# Altium schematic sheet MCU.SchDoc
size A4
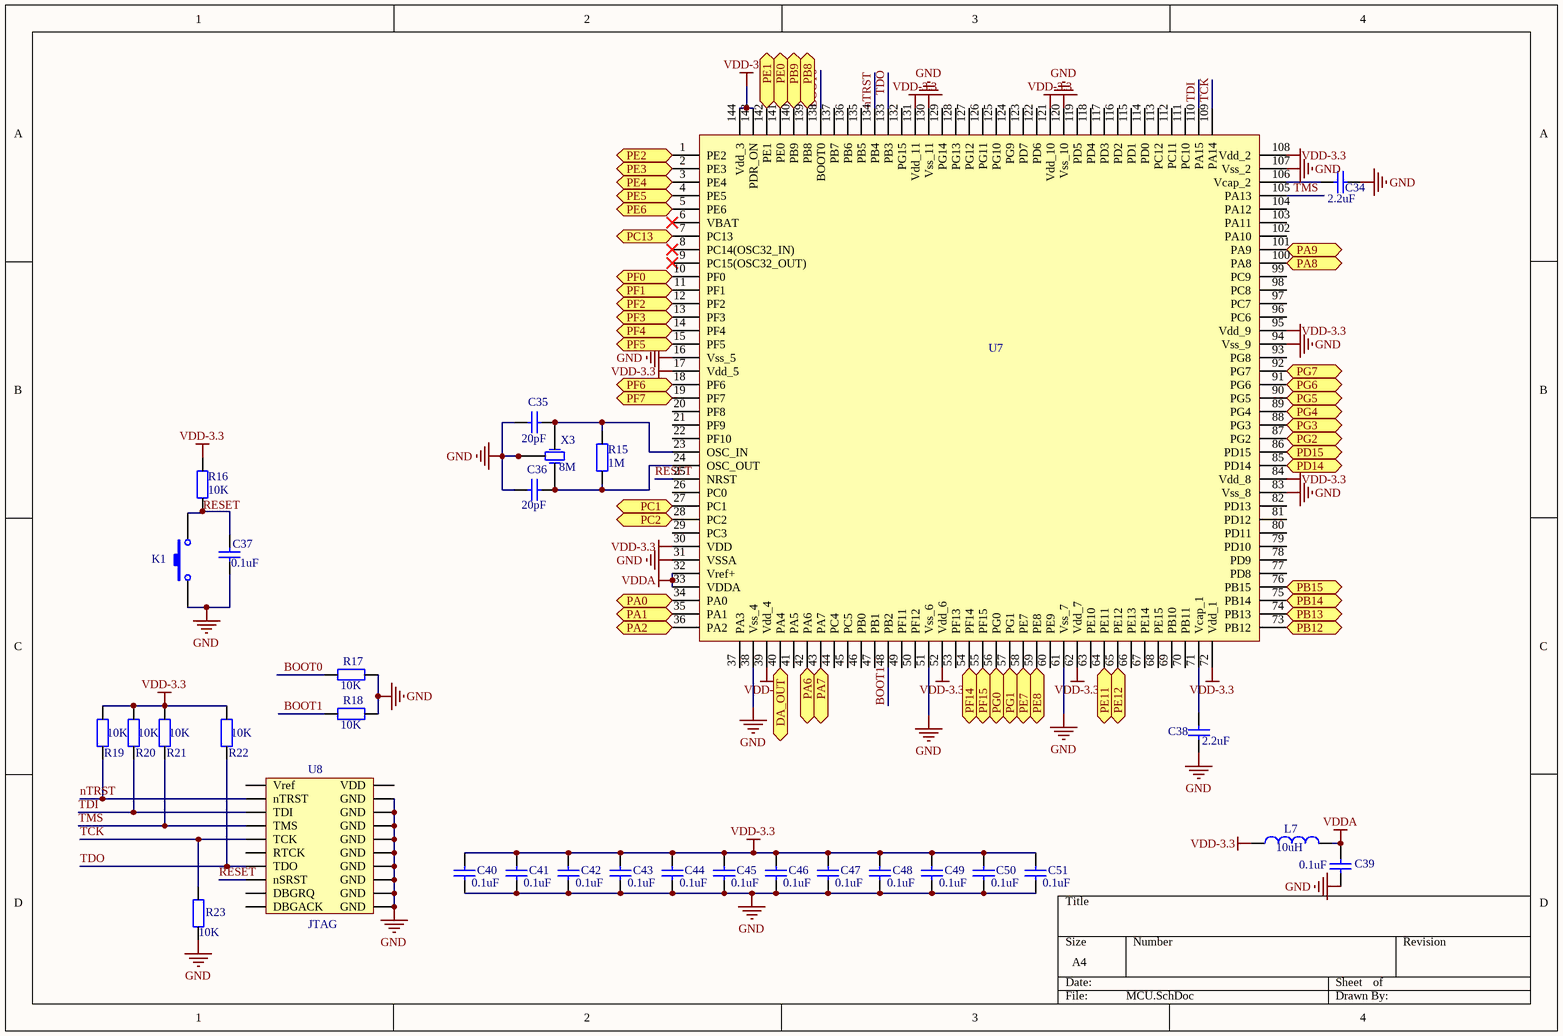
[diagram p0: MCU.SchDoc]

## Parts
C34  value 2.2uF  [0603]  (hidden comment: Capacitor-0603)
C35  value 20pF  [0603]  (hidden comment: Capacitor-0603)
C36  value 20pF  [0603]  (hidden comment: Capacitor-0603)
C37  value 0.1uF  [0603]  (hidden comment: Capacitor-0805)
C38  value 2.2uF  [0603]  (hidden comment: Capacitor-0603)
C39  value 0.1uF  [0603]  (hidden comment: Capacitor-0805)
C40  value 0.1uF  [0603]  (hidden comment: Capacitor-0603)
C41  value 0.1uF  [0603]  (hidden comment: Capacitor-0603)
C42  value 0.1uF  [0603]  (hidden comment: Capacitor-0603)
C43  value 0.1uF  [0603]  (hidden comment: Capacitor-0603)
C44  value 0.1uF  [0603]  (hidden comment: Capacitor-0603)
C45  value 0.1uF  [0603]  (hidden comment: Capacitor-0603)
C46  value 0.1uF  [0603]  (hidden comment: Capacitor-0603)
C47  value 0.1uF  [0603]  (hidden comment: Capacitor-0603)
C48  value 0.1uF  [0603]  (hidden comment: Capacitor-0603)
C49  value 0.1uF  [0603]  (hidden comment: Capacitor-0603)
C50  value 0.1uF  [0603]  (hidden comment: Capacitor-0603)
C51  value 0.1uF  [0603]  (hidden comment: Capacitor-0603)
K1  按键  [贴片按键]  (value not drawn)
L7  value 10uH  [0805]  (hidden comment: Inductor)
R15  value 1M  [0603]  (hidden comment: Resistor-0603)
R16  value 10K  [0603]  (hidden comment: Resistor-0805)
R17  value 10K  [0603]  (hidden comment: Resistor-0805)
R18  value 10K  [0603]  (hidden comment: Resistor-0805)
R19  value 10K  [0603]  (hidden comment: Resistor-0805)
R20  value 10K  [0603]  (hidden comment: Resistor-0805)
R21  value 10K  [0603]  (hidden comment: Resistor-0805)
R22  value 10K  [0603]  (hidden comment: Resistor-0805)
R23  value 10K  [0603]  (hidden comment: Resistor-0805)
U7  value STM32F407ZET6  [Stm32f407ZET6 - duplicate]  (hidden comment: STM32F407ZGT6)
U8  JTAG  [JTAG-20]
X3  value 8M  [3225无源晶振]  (hidden comment: 3225无源晶振)

## Ports
DA_OUT (out), PA0 (out), PA1 (out), PA2 (out), PA6 (out), PA7 (out), PA8, PA9, PB8 (out), PB9 (out), PB12, PB13, PB14, PB15, PC1 (out), PC2 (out), PC13 (out), PD14, PD15, PE0 (out), PE1 (out), PE2 (out), PE3 (out), PE4 (out), PE5 (out), PE6 (out), PE7 (out), PE8 (out), PE11 (out), PE12 (out), PF0 (out), PF1 (out), PF2 (out), PF3 (out), PF4 (out), PF5 (out), PF6 (out), PF7 (out), PF14 (out), PF15 (out), PG0 (out), PG1 (out), PG2, PG3, PG4, PG5, PG6, PG7

## Nets
GND: C34.2 C35.1 C36.1 C37.1 C38.1 C39.1 C40.1 C41.1 C42.1 C43.1 C44.1 C45.1 C46.1 C47.1 C48.1 C49.1 C50.1 C51.1 K1.1 R17.1 R18.1 R23.1 U7.16(Vss_5) U7.31(VSSA) U7.38(Vss_4) U7.51(Vss_6) U7.61(Vss_7) U7.83(Vss_8) U7.94(Vss_9) U7.107(Vss_2) U7.120(Vss_10) U7.130(Vss_11) U8.4(GND) U8.6(GND) U8.8(GND) U8.10(GND) U8.12(GND) U8.14(GND) U8.16(GND) U8.18(GND) U8.20(GND) X3.2(GND) X3.4(GND)
VDD-3.3: C40.2 C41.2 C42.2 C43.2 C44.2 C45.2 C46.2 C47.2 C48.2 C49.2 C50.2 C51.2 L7.1 R16.2 R19.2 R20.2 R21.2 R22.2 U7.17(Vdd_5) U7.30(VDD) U7.39(Vdd_4) U7.52(Vdd_6) U7.62(Vdd_7) U7.72(Vdd_1) U7.84(Vdd_8) U7.95(Vdd_9) U7.108(Vdd_2) U7.121(Vdd_10) U7.131(Vdd_11) U7.143(PDR_ON) U7.144(Vdd_3)
VDDA: C39.2 L7.2 U7.32(Vref+) U7.33(VDDA)
BOOT0: R17.2 U7.138(BOOT0)
BOOT1: R18.2 U7.48(PB2)
DA_OUT: U7.40(PA4) ; port DA_OUT
nTRST: R19.1 U7.134(PB4) U8.3(nTRST)
PA0: U7.34(PA0) ; port PA0
PA1: U7.35(PA1) ; port PA1
PA2: U7.36(PA2) ; port PA2
PA6: U7.42(PA6) ; port PA6
PA7: U7.43(PA7) ; port PA7
PA8: U7.100(PA8) ; port PA8
PA9: U7.101(PA9) ; port PA9
PB8: U7.139(PB8) ; port PB8
PB9: U7.140(PB9) ; port PB9
PB12: U7.73(PB12) ; port PB12
PB13: U7.74(PB13) ; port PB13
PB14: U7.75(PB14) ; port PB14
PB15: U7.76(PB15) ; port PB15
PC1: U7.27(PC1) ; port PC1
PC2: U7.28(PC2) ; port PC2
PC13: U7.7(PC13) ; port PC13
PD14: U7.85(PD14) ; port PD14
PD15: U7.86(PD15) ; port PD15
PE0: U7.141(PE0) ; port PE0
PE1: U7.142(PE1) ; port PE1
PE2: U7.1(PE2) ; port PE2
PE3: U7.2(PE3) ; port PE3
PE4: U7.3(PE4) ; port PE4
PE5: U7.4(PE5) ; port PE5
PE6: U7.5(PE6) ; port PE6
PE7: U7.58(PE7) ; port PE7
PE8: U7.59(PE8) ; port PE8
PE11: U7.64(PE11) ; port PE11
PE12: U7.65(PE12) ; port PE12
PF0: U7.10(PF0) ; port PF0
PF1: U7.11(PF1) ; port PF1
PF2: U7.12(PF2) ; port PF2
PF3: U7.13(PF3) ; port PF3
PF4: U7.14(PF4) ; port PF4
PF5: U7.15(PF5) ; port PF5
PF6: U7.18(PF6) ; port PF6
PF7: U7.19(PF7) ; port PF7
PF14: U7.54(PF14) ; port PF14
PF15: U7.55(PF15) ; port PF15
PG0: U7.56(PG0) ; port PG0
PG1: U7.57(PG1) ; port PG1
PG2: U7.87(PG2) ; port PG2
PG3: U7.88(PG3) ; port PG3
PG4: U7.89(PG4) ; port PG4
PG5: U7.90(PG5) ; port PG5
PG6: U7.91(PG6) ; port PG6
PG7: U7.92(PG7) ; port PG7
RESET: C37.2 K1.2 R16.1 U7.25(NRST) U8.15(nSRST)
TCK: R23.2 U7.109(PA14) U8.9(TCK)
TDI: R20.1 U7.110(PA15) U8.5(TDI)
TDO: R22.1 U7.133(PB3) U8.13(TDO)
TMS: R21.1 U7.105(PA13) U8.7(TMS)
NetC34_1: C34.1 U7.106(Vcap_2)
NetC35_2: C35.2 R15.2 U7.23(OSC_IN) X3.1(OSC1)
NetC36_2: C36.2 R15.1 U7.24(OSC_OUT) X3.3(OSC2)
NetC38_2: C38.2 U7.71(Vcap_1)

Not connected (* = marked no-connect by the designer): U7 6(VBAT)* 8(PC14(OSC32_IN))* 9(PC15(OSC32_OUT))* 20(PF8) 21(PF9) 22(PF10) 26(PC0) 29(PC3) 37(PA3) 41(PA5) 44(PC4) 45(PC5) 46(PB0) 47(PB1) 49(PF11) 50(PF12) 53(PF13) 60(PE9) 63(PE10) 66(PE13) 67(PE14) 68(PE15) 69(PB10) 70(PB11) 77(PD8) 78(PD9) 79(PD10) 80(PD11) 81(PD12) 82(PD13) 93(PG8) 96(PC6) 97(PC7) 98(PC8) 99(PC9) 102(PA10) 103(PA11) 104(PA12) 111(PC10) 112(PC11) 113(PC12) 114(PD0) 115(PD1) 116(PD2) 117(PD3) 118(PD4) 119(PD5) 122(PD6) 123(PD7) 124(PG9) 125(PG10) 126(PG11) 127(PG12) 128(PG13) 129(PG14) 132(PG15) 135(PB5) 136(PB6) 137(PB7); U8 1(Vref) 2(VDD) 11(RTCK) 17(DBGRQ) 19(DBGACK)

## Library data of the parts
C37 = Capacitor-0
C39 = Capacitor
L7 = Ind
R16-R23 = Resistor-0
U7 = STM32F407ZET6
U8 = J: Value: JTAG